# EAGLE design step_down (EAGLE 7.7.0)
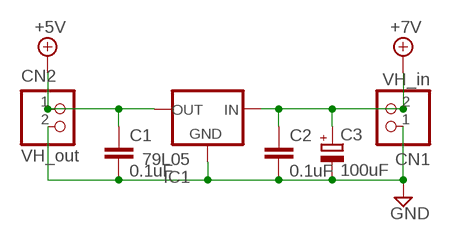
[diagram p0: schematic, sheet 1]

## Parts
C1  0.1uF  C-EU050-025X075  [C050-025X075]
C2  0.1uF  C-EU050-025X075  [C050-025X075]
C3  100uF  CPOL-EUE2-5  [E2-5]
CN1  VH_in  B2P-VH  [B2P-VH]
CN2  VH_out  B2P-VH  [B2P-VH]
IC1  79L05  79LXX  [79LXX]

## Nets
+5V: C1.1 CN2.1 IC1.OUT
+7V: C2.1 C3.+ CN1.2 IC1.IN
GND: C1.2 C2.2 C3.- CN1.1 CN2.2 IC1.GND

## Library data of the parts
C1 C2 = resistor:C-EU: CAPACITOR, European symbol
C3 = resistor:CPOL-EU: POLARIZED CAPACITOR, European symbol
CN1 CN2 = jst-vh:B2P-VH: Wire-to-Board 3.96mm pitch top mount connector Source: http://www.jst-mfg.com/product/pdf/jpn/VH.pdf http://www.jst-mfg.com/product/detail.php?series=262
IC1 = v-reg:79LXX: VOLTAGE REGULATOR

## Board
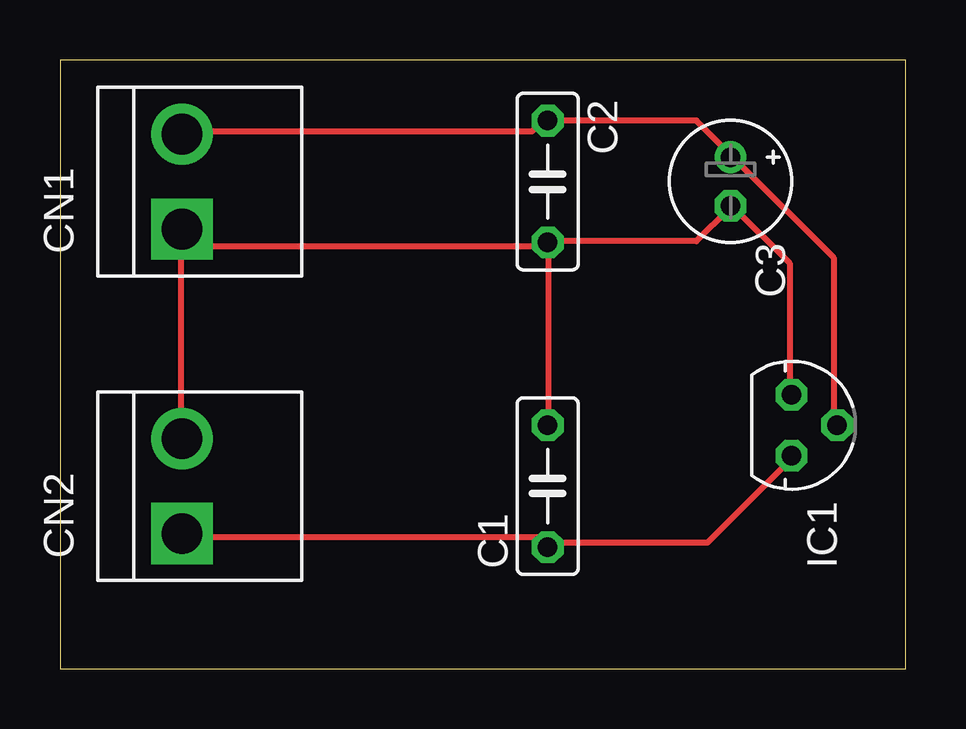
[diagram p1: board, top side]

Size 35.23 x 25.39 mm. Coordinates in mm from the lower left corner, seen from the top.
Outline: 0,0 35.23,0 35.23,25.39 0,25.39 0,0
Copper layers (1*16): Top 0.035mm / dielectric 1.5mm / Bottom 0.035mm
Design rules "default": minimum track width 10mil, minimum drill 24mil, track to track 8mil, track to pad 8mil, pad to pad 8mil, via to via 8mil, smd to smd 8mil, copper to edge 40mil, drill to drill 8mil, minimum pad ring 10mil, minimum via ring 8mil, stop-mask expansion 4mil, vias tented up to drill 0mil, thermal gap 10mil

### Footprints (pad centres in the part's own frame; a part is rotated, then mirrored left to right if it is on the bottom)
C050-025X075 = drill 0.813 octagon: 1 -2.54,0; 2 2.54,0
E2-5 = drill 0.813 pad 1.27: + -1.016,0 | drill 0.813 pad 1.27 octagon: - 1.016,0
B2P-VH = drill 1.7 square: 1 -1.98,0 | drill 1.7: 2 1.98,0
79LXX = drill 0.813 octagon: GND -1.27,0; IN 0,1.905; OUT 1.27,0

### Placement (x,y rotation side)
C1  20.32,7.62 90 top
C2  20.32,20.32 270 top
C3  27.94,20.32 270 top
CN1  5.08,20.32 90 top
CN2  5.08,7.62 90 top
IC1  30.48,10.16 270 top

### Tracks (layer width: path | path; a pad name or v marks a point on that pad's centre or on a via)
+5V
  Top 0.254: IC1.OUT 30.4,8.69 26.98,5.26 20.34,5.26 C1.1 20.12,5.26 19.89,5.49 5.26,5.49 CN2.1
+7V
  Top 0.254: IC1.IN 32.23,10.29 32.23,17.14 28.12,21.26 C3.+ 27.89,21.49 26.52,22.86 C2.1 20.12,22.86 19.66,22.4 5.26,22.4 CN1.2
GND
  Top 0.254: 5.03,17.6 5.03,18.29 CN1.1 5.03,17.6 | 5.03,17.6 5.03,9.6 CN2.2 | C1.2 20.34,10.29 20.34,17.6 C2.2 | IC1.GND 30.4,11.43 30.4,16.92 28.12,19.2 C3.- 27.89,19.2 26.52,17.83 20.34,17.83 C2.2 | 5.03,17.6 20.12,17.6 C2.2